# Altium project TPMS v1.0.0.PrjPcb
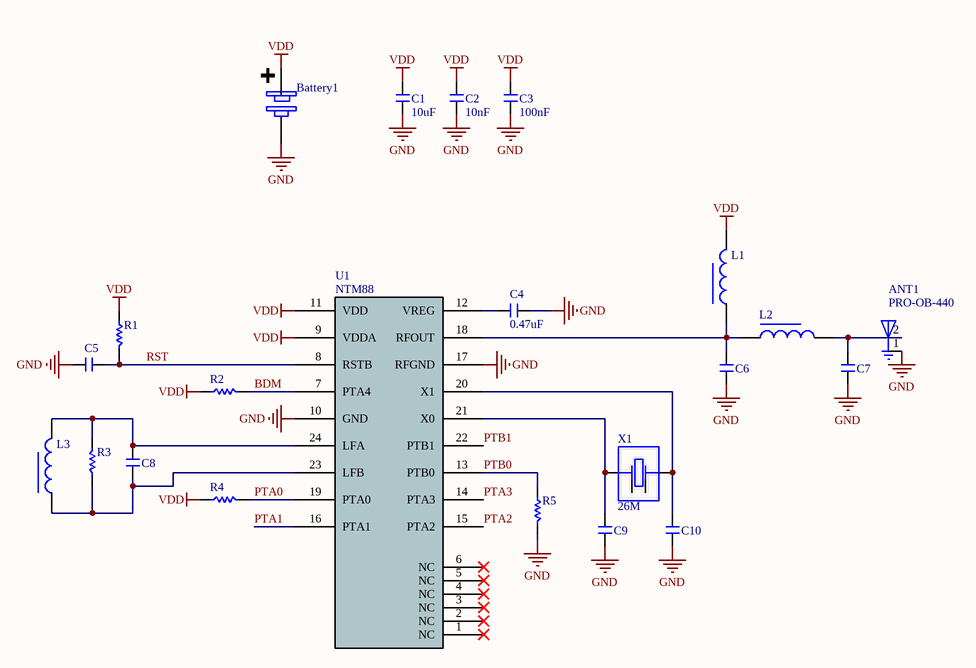
[diagram p0: Main.SchDoc]
1 sheet, 22 parts. Net scope: global (net labels, ports and power ports of the same name join across sheets).
Board file: TPMS V1.0.0 PCB.PcbDoc

## Sheet Main.SchDoc
size A; SheetNumber: 1; SheetTotal: 1

### Parts
ANT1  PRO-OB-440  [PRO-OB-440]
Battery1  Battery Button Cell  [CR1220_B]  (value not drawn)
C1  10uF  [C 0603]
C2  10nF  [C 0603]
C3  100nF  [C 0603]
C4  0.47uF  [C 0603]
C5  ?  [C 0603]  (value not drawn)
C6  ?  [C 0603]  (value not drawn)
C7  ?  [C 0603]  (value not drawn)
C8  ?  [C 0603]  (value not drawn)
C9  CRYSTAL REC  [C 0603]  (value not drawn)
C10  CRYSTAL REC  [C 0603]  (value not drawn)
L1  ?uH  [L 0603]  (value not drawn)
L2  ?uH  [L 0603]  (value not drawn)
L3  ?uH  [L 0603]  (value not drawn)
R1  ?  [R 0603]  (value not drawn)
R2  ?  [R 0603]  (value not drawn)
R3  ?  [R 0603]  (value not drawn)
R4  ?  [R 0603]  (value not drawn)
R5  1K  [R 0603]  (value not drawn)
U1  NTM88  [QFN24]
X1  26M  [XTAL-2520-4]

### Nets
GND: ANT1.1(GND) Battery1.2(-) C1.1 C2.1 C3.1 C4.1 C5.1 C6.1 C7.1 C9.1 C10.1 R5.2 U1.10(GND) U1.17(RFGND)
VDD: Battery1.1(+) C1.2 C2.2 C3.2 L1.2 R1.1 R2.1 R4.1 U1.9(VDDA) U1.11(VDD)
BDM: R2.2 U1.7(PTA4)
PTA0: R4.2 U1.19(PTA0)
PTA1: U1.16(PTA1)
PTA2: U1.15(PTA2)
PTA3: U1.14(PTA3)
PTB0: R5.1 U1.13(PTB0)
PTB1: U1.22(PTB1)
RST: C5.2 R1.2 U1.8(RSTB)
NetANT1_2: ANT1.2(FEED) C7.2 L2.2
NetC4_2: C4.2 U1.12(VREG)
NetC6_2: C6.2 L1.1 L2.1 U1.18(RFOUT)
NetC8_1: C8.1 L3.1 R3.1 U1.23(LFB)
NetC8_2: C8.2 L3.2 R3.2 U1.24(LFA)
NetC9_2: C9.2 U1.21(X0) X1.1
NetC10_2: C10.2 U1.20(X1) X1.3

Not connected (* = marked no-connect by the designer): U1 1(NC)* 2(NC)* 3(NC)* 4(NC)* 5(NC)* 6(NC)*; X1 2 4

### Library data of the parts
Battery1 = Battery Button Cell: Mini Battery
C1-C10 = C: Non-polar patch capacitor; BOM名称: 无极性贴片电容; 版权归属: 源创客; 学习资源: www.ooocke.com
L1-L3 = L: Low power chip inductor; BOM名称: 小功率贴片电感; 版权归属: 源创客; 学习资源: www.ooocke.com
R1-R5 = R: Chip resistor; 版权归属: 源创客; BOM名称: Chip resistor; 学习资源: www.ooocke.com
U1 = NTM88: TPMS Sensor
X1 = XTAL-4: 4-Pin crystal; BOM名称: 4脚晶振; 版权归属: 源创客; 学习资源: www.ooocke.com